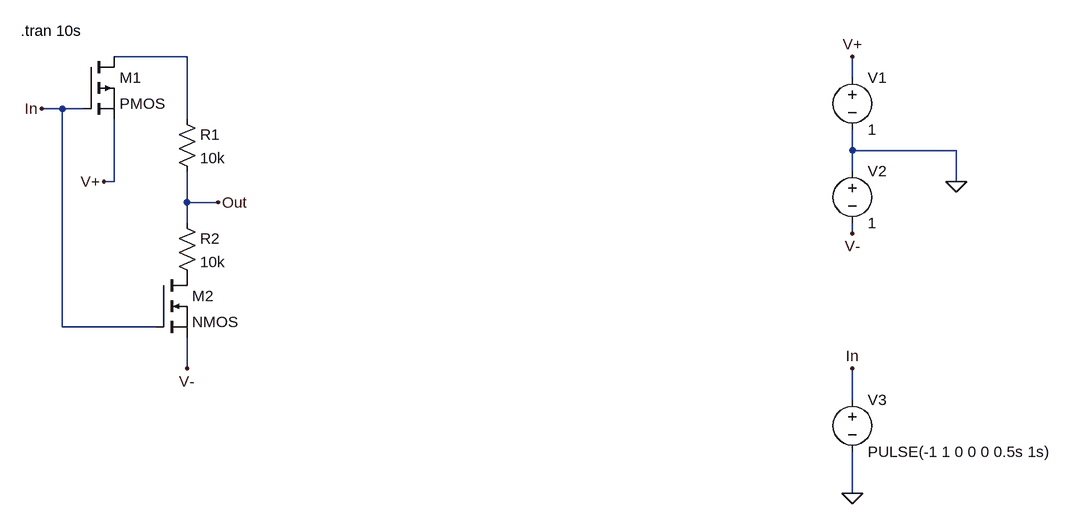
[diagram p0: schematic TNOT.asc]
TNOT.asc, the LTspice schematic file:
Version 4
SHEET 1 1456 680
WIRE -432 -416 -544 -416
WIRE 592 -384 592 -416
WIRE -624 -336 -656 -336
WIRE -592 -336 -624 -336
WIRE -432 -320 -432 -416
WIRE 592 -272 592 -304
WIRE 752 -272 592 -272
WIRE 592 -240 592 -272
WIRE -544 -224 -544 -320
WIRE -544 -224 -560 -224
WIRE 752 -224 752 -272
WIRE -432 -192 -432 -240
WIRE -384 -192 -432 -192
WIRE -432 -160 -432 -192
WIRE 592 -144 592 -160
WIRE -624 0 -624 -336
WIRE -480 0 -624 0
WIRE -432 64 -432 16
WIRE 592 112 592 64
WIRE 592 256 592 192
FLAG 752 -224 0
FLAG 592 -416 V+
FLAG -560 -224 V+
FLAG 592 -144 V-
FLAG -432 64 V-
FLAG -656 -336 In
FLAG -384 -192 Out
FLAG 592 256 0
FLAG 592 64 In
SYMBOL pmos -592 -416 R0
SYMATTR InstName M1
SYMBOL Voltage 592 -400 R0
SYMATTR InstName V1
SYMATTR Value 1
SYMBOL voltage 592 -256 R0
SYMATTR InstName V2
SYMATTR Value 1
SYMBOL Res -448 -336 R0
SYMATTR InstName R1
SYMATTR Value 10k
SYMBOL Res -448 -176 R0
SYMATTR InstName R2
SYMATTR Value 10k
SYMBOL nmos -480 -80 R0
SYMATTR InstName M2
SYMBOL voltage 592 96 R0
SYMATTR InstName V3
SYMATTR Value PULSE(-1 1 0 0 0 0.5s 1s)
TEXT -688 -456 Left 2 !.tran 10s

The netlist it stands for:
* TNOT.asc
M1 N001 In V+ V+ PMOS
V1 V+ 0 1
V2 0 V- 1
R1 N001 Out 10k
R2 Out P001 10k
M2 P001 In V- V- NMOS
V3 In 0 PULSE(-1 1 0 0 0 0.5s 1s)
.model NMOS NMOS
.model PMOS PMOS
.lib standard.mos
.tran 10s
.backanno
.end